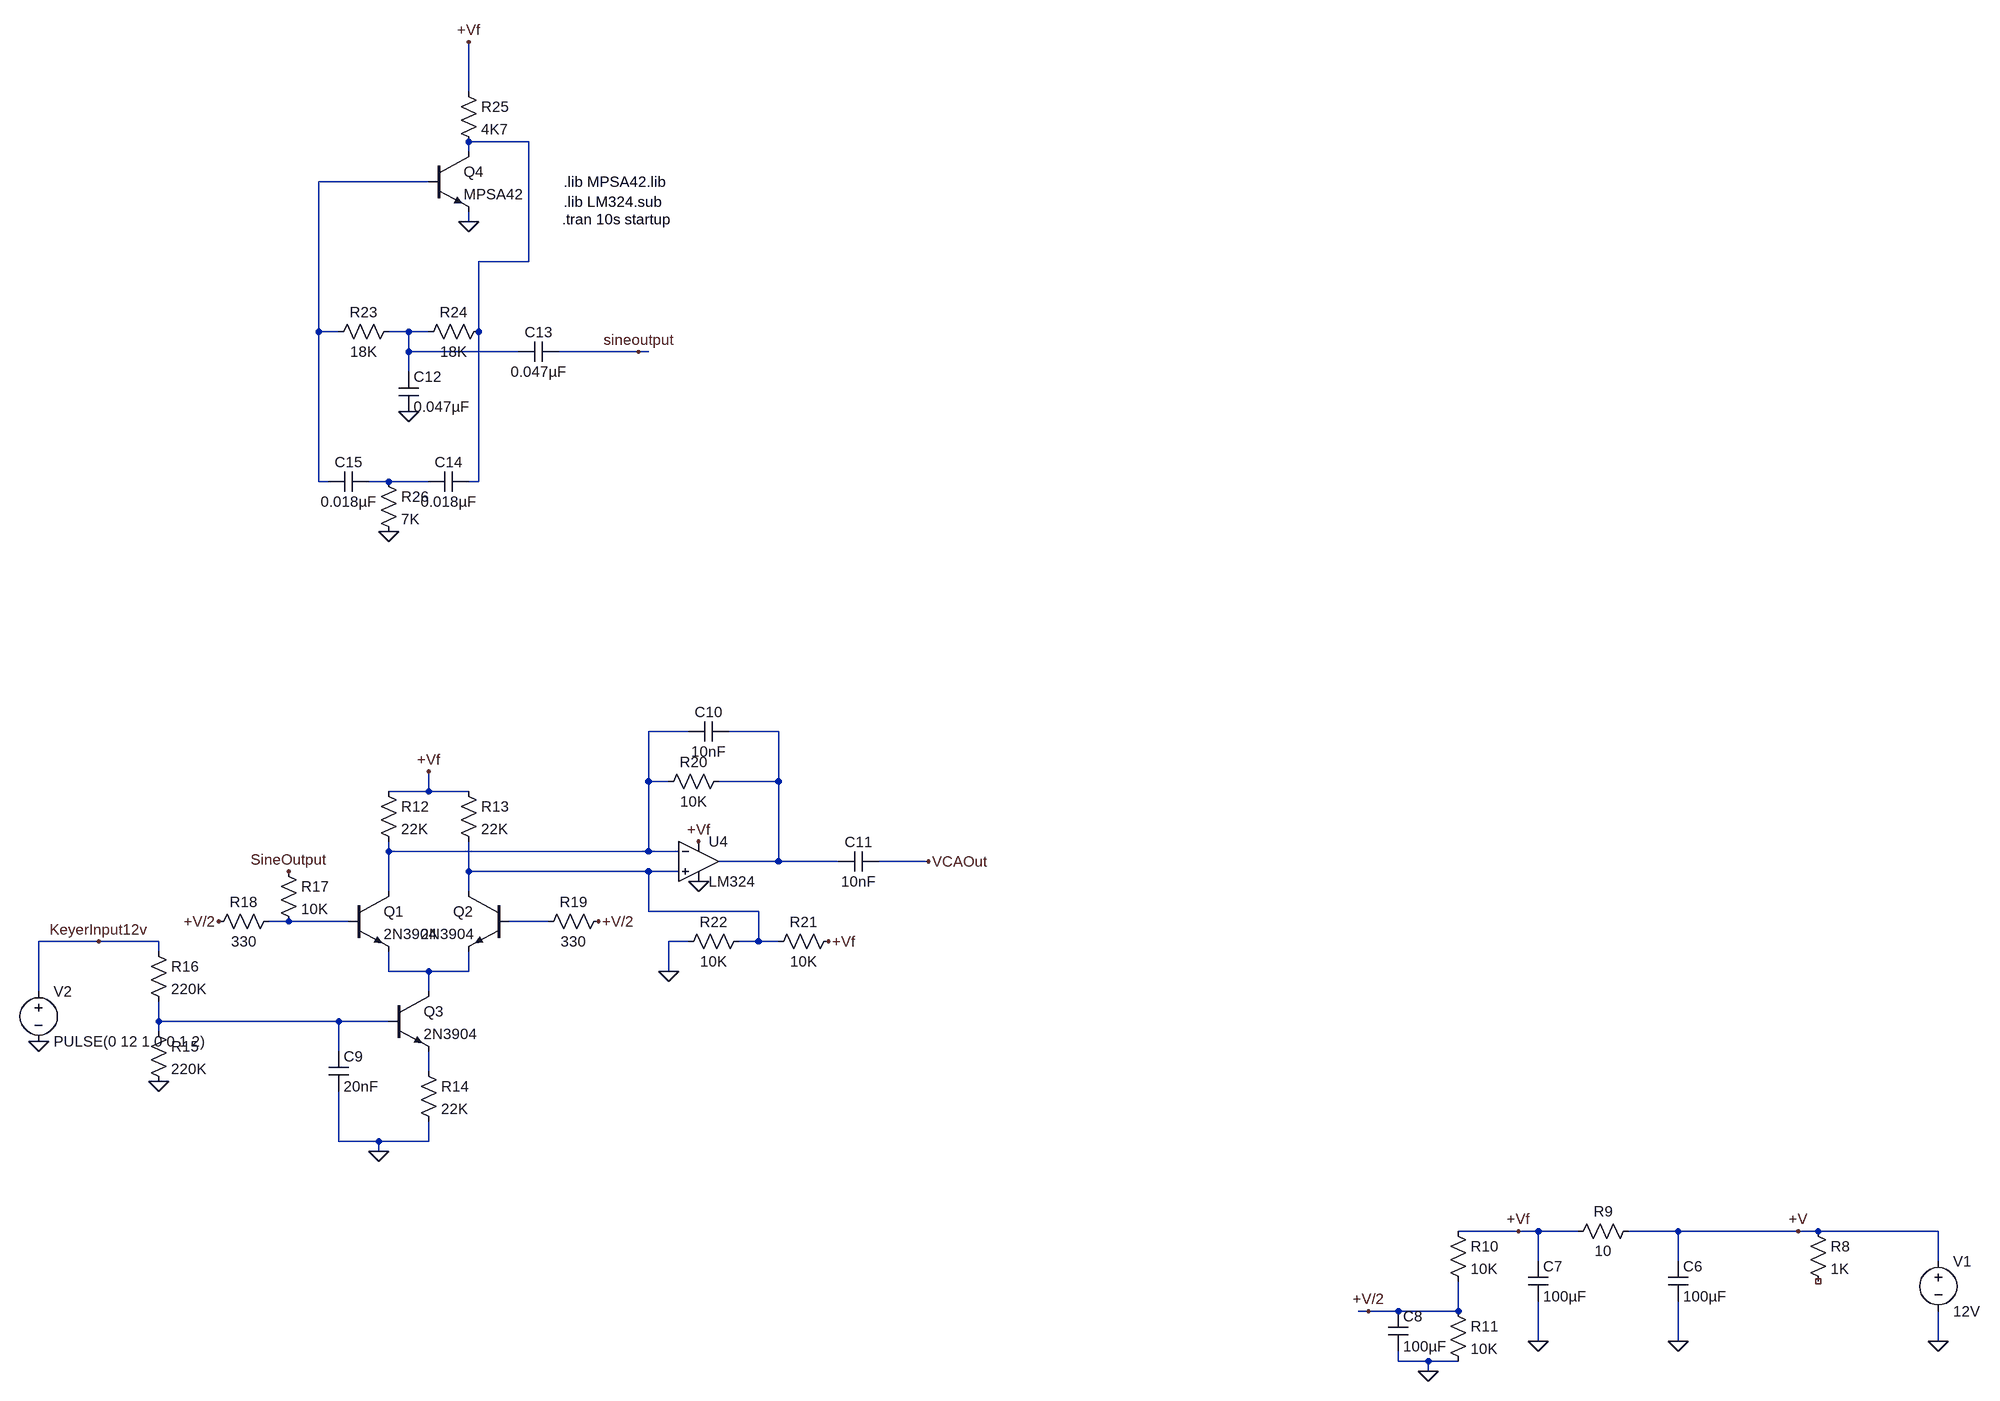
[diagram p0: schematic ClicklessOscilator_WithToneControl.asc]
ClicklessOscilator_WithToneControl.asc, the LTspice schematic file:
Version 4
SHEET 1 2764 1652
WIRE 304 -416 304 -496
WIRE 400 -336 304 -336
WIRE 304 -320 304 -336
WIRE 240 -272 64 -272
WIRE 304 -208 304 -224
WIRE 400 -144 400 -336
WIRE 400 -144 320 -144
WIRE 64 -32 64 -272
WIRE 96 -32 64 -32
WIRE 208 -32 176 -32
WIRE 240 -32 208 -32
WIRE 320 -32 320 -144
WIRE 208 0 208 -32
WIRE 384 0 208 0
WIRE 576 0 448 0
WIRE 592 0 576 0
WIRE 208 32 208 0
WIRE 64 208 64 -32
WIRE 80 208 64 208
WIRE 176 208 144 208
WIRE 240 208 176 208
WIRE 320 208 320 -32
WIRE 320 208 304 208
WIRE 656 608 592 608
WIRE 800 608 720 608
WIRE 592 688 592 608
WIRE 624 688 592 688
WIRE 800 688 800 608
WIRE 800 688 704 688
WIRE 240 704 240 672
WIRE 240 704 176 704
WIRE 304 704 240 704
WIRE 176 800 176 784
WIRE 592 800 592 688
WIRE 592 800 176 800
WIRE 640 800 592 800
WIRE 800 816 800 688
WIRE 800 816 704 816
WIRE 896 816 800 816
WIRE 1040 816 960 816
WIRE 304 832 304 784
WIRE 592 832 304 832
WIRE 640 832 592 832
WIRE 176 864 176 800
WIRE 304 864 304 832
WIRE 592 896 592 832
WIRE 768 896 592 896
WIRE 16 912 -16 912
WIRE 112 912 16 912
WIRE 432 912 368 912
WIRE -288 944 -384 944
WIRE -192 944 -288 944
WIRE 656 944 624 944
WIRE 768 944 768 896
WIRE 768 944 736 944
WIRE 800 944 768 944
WIRE -192 960 -192 944
WIRE 176 992 176 960
WIRE 240 992 176 992
WIRE 304 992 304 960
WIRE 304 992 240 992
WIRE 624 992 624 944
WIRE -384 1024 -384 944
WIRE 240 1024 240 992
WIRE -192 1072 -192 1040
WIRE 96 1072 -192 1072
WIRE 176 1072 96 1072
WIRE -192 1088 -192 1072
WIRE 96 1120 96 1072
WIRE 240 1152 240 1120
WIRE 96 1264 96 1184
WIRE 160 1264 96 1264
WIRE 240 1264 240 1232
WIRE 240 1264 160 1264
WIRE 160 1280 160 1264
WIRE 1984 1408 1888 1408
WIRE 2016 1408 1984 1408
WIRE 2080 1408 2016 1408
WIRE 2240 1408 2160 1408
WIRE 2432 1408 2240 1408
WIRE 2464 1408 2432 1408
WIRE 2656 1408 2464 1408
WIRE 2016 1456 2016 1408
WIRE 2240 1456 2240 1408
WIRE 2656 1456 2656 1408
WIRE 1744 1536 1728 1536
WIRE 1792 1536 1744 1536
WIRE 1888 1536 1888 1488
WIRE 1888 1536 1792 1536
WIRE 2016 1584 2016 1520
WIRE 2240 1584 2240 1520
WIRE 2656 1584 2656 1536
WIRE 1792 1616 1792 1600
WIRE 1840 1616 1792 1616
WIRE 1888 1616 1840 1616
WIRE 1840 1632 1840 1616
FLAG 304 -496 +Vf
FLAG 2656 1584 0
FLAG 2240 1584 0
FLAG 2016 1584 0
FLAG 1840 1632 0
FLAG 2432 1408 +V
FLAG 1984 1408 +Vf
FLAG 1744 1536 +V/2
FLAG 240 672 +Vf
FLAG 160 1280 0
FLAG -288 944 KeyerInput12v
FLAG -192 1168 0
FLAG -384 1104 0
FLAG 16 832 SineOutput
FLAG -96 912 +V/2
FLAG 512 912 +V/2
FLAG 672 784 +Vf
FLAG 672 848 0
FLAG 1040 816 VCAOut
FLAG 880 944 +Vf
FLAG 624 992 0
FLAG 208 96 0
FLAG 176 288 0
FLAG 576 0 sineoutput
FLAG 304 -208 0
SYMBOL voltage 2656 1440 R0
WINDOW 123 0 0 Left 2
WINDOW 39 0 0 Left 2
SYMATTR InstName V1
SYMATTR Value 12V
SYMBOL res 2448 1392 R0
SYMATTR InstName R8
SYMATTR Value 1K
SYMBOL cap 2224 1456 R0
SYMATTR InstName C6
SYMATTR Value 100µF
SYMBOL res 2176 1392 R90
WINDOW 0 0 56 VBottom 2
WINDOW 3 32 56 VTop 2
SYMATTR InstName R9
SYMATTR Value 10
SYMBOL cap 2000 1456 R0
SYMATTR InstName C7
SYMATTR Value 100µF
SYMBOL res 1872 1392 R0
SYMATTR InstName R10
SYMATTR Value 10K
SYMBOL res 1872 1520 R0
SYMATTR InstName R11
SYMATTR Value 10K
SYMBOL cap 1776 1536 R0
SYMATTR InstName C8
SYMATTR Value 100µF
SYMBOL npn 112 864 R0
SYMATTR InstName Q1
SYMATTR Value 2N3904
SYMBOL npn 368 864 M0
SYMATTR InstName Q2
SYMATTR Value 2N3904
SYMBOL npn 176 1024 R0
SYMATTR InstName Q3
SYMATTR Value 2N3904
SYMBOL res 160 688 R0
SYMATTR InstName R12
SYMATTR Value 22K
SYMBOL res 288 688 R0
SYMATTR InstName R13
SYMATTR Value 22K
SYMBOL res 224 1136 R0
SYMATTR InstName R14
SYMATTR Value 22K
SYMBOL cap 80 1120 R0
SYMATTR InstName C9
SYMATTR Value 20nF
SYMBOL res -208 1072 R0
SYMATTR InstName R15
SYMATTR Value 220K
SYMBOL res -208 944 R0
SYMATTR InstName R16
SYMATTR Value 220K
SYMBOL voltage -384 1008 R0
WINDOW 123 0 0 Left 2
WINDOW 39 0 0 Left 2
SYMATTR InstName V2
SYMATTR Value PULSE(0 12 1 0 0 1 2)
SYMBOL res 0 816 R0
SYMATTR InstName R17
SYMATTR Value 10K
SYMBOL res 0 896 R90
WINDOW 0 0 56 VBottom 2
WINDOW 3 32 56 VTop 2
SYMATTR InstName R18
SYMATTR Value 330
SYMBOL res 528 896 R90
WINDOW 0 0 56 VBottom 2
WINDOW 3 32 56 VTop 2
SYMATTR InstName R19
SYMATTR Value 330
SYMBOL Opamps\\opamp2 672 752 R0
SYMATTR InstName U4
SYMATTR Value LM324
SYMBOL res 720 672 R90
WINDOW 0 0 56 VBottom 2
WINDOW 3 32 56 VTop 2
SYMATTR InstName R20
SYMATTR Value 10K
SYMBOL cap 720 592 R90
WINDOW 0 0 32 VBottom 2
WINDOW 3 32 32 VTop 2
SYMATTR InstName C10
SYMATTR Value 10nF
SYMBOL cap 960 800 R90
WINDOW 0 0 32 VBottom 2
WINDOW 3 32 32 VTop 2
SYMATTR InstName C11
SYMATTR Value 10nF
SYMBOL res 896 928 R90
WINDOW 0 0 56 VBottom 2
WINDOW 3 32 56 VTop 2
SYMATTR InstName R21
SYMATTR Value 10K
SYMBOL res 752 928 R90
WINDOW 0 0 56 VBottom 2
WINDOW 3 32 56 VTop 2
SYMATTR InstName R22
SYMATTR Value 10K
SYMBOL res 192 -48 R90
WINDOW 0 0 56 VBottom 2
WINDOW 3 32 56 VTop 2
SYMATTR InstName R23
SYMATTR Value 18K
SYMBOL res 336 -48 R90
WINDOW 0 0 56 VBottom 2
WINDOW 3 32 56 VTop 2
SYMATTR InstName R24
SYMATTR Value 18K
SYMBOL res 288 -432 R0
SYMATTR InstName R25
SYMATTR Value 4K7
SYMBOL res 160 192 R0
SYMATTR InstName R26
SYMATTR Value 7K
SYMBOL cap 192 32 R0
SYMATTR InstName C12
SYMATTR Value 0.047µF
SYMBOL cap 448 -16 R90
WINDOW 0 0 32 VBottom 2
WINDOW 3 32 32 VTop 2
SYMATTR InstName C13
SYMATTR Value 0.047µF
SYMBOL npn 240 -320 R0
SYMATTR InstName Q4
SYMATTR Value MPSA42
SYMBOL cap 304 192 R90
WINDOW 0 0 32 VBottom 2
WINDOW 3 32 32 VTop 2
SYMATTR InstName C14
SYMATTR Value 0.018µF
SYMBOL cap 144 192 R90
WINDOW 0 0 32 VBottom 2
WINDOW 3 32 32 VTop 2
SYMATTR InstName C15
SYMATTR Value 0.018µF
TEXT 454 -212 Left 2 !.tran 10s startup
TEXT 456 -240 Left 2 !.lib LM324.sub
TEXT 456 -272 Left 2 !.lib MPSA42.lib

The netlist it stands for:
* ClicklessOscilator_WithToneControl.asc
V1 +V 0 12V
R8 +V NC_01 1K
C6 +V 0 100µF
R9 +V +Vf 10
C7 +Vf 0 100µF
R10 +Vf +V/2 10K
R11 +V/2 0 10K
C8 +V/2 0 100µF
Q1 N005 N008 N010 0 2N3904
Q2 N007 N009 N010 0 2N3904
Q3 N010 N011 N012 0 2N3904
R12 +Vf N005 22K
R13 +Vf N007 22K
R14 N012 0 22K
C9 N011 0 20nF
R15 N011 0 220K
R16 KeyerInput12v N011 220K
V2 KeyerInput12v 0 PULSE(0 12 1 0 0 1 2)
R17 SineOutput N008 10K
R18 N008 +V/2 330
R19 +V/2 N009 330
XU4 N007 N005 +Vf 0 N006 LM324  ; pins In+ In- V+ V- OUT
R20 N006 N005 10K
C10 N006 N005 10nF
C11 VCAOut N006 10nF
R21 +Vf N007 10K
R22 N007 0 10K
R23 N003 N002 18K
R24 N001 N003 18K
R25 +Vf N001 4K7
R26 N004 0 7K
C12 N003 0 0.047µF
C13 SineOutput N003 0.047µF
Q4 N001 N002 0 0 MPSA42
C14 N001 N004 0.018µF
C15 N004 N002 0.018µF
.model NPN NPN
.model PNP PNP
.lib standard.bjt
.tran 10s startup
.lib LM324.sub
.lib MPSA42.lib
.backanno
.end